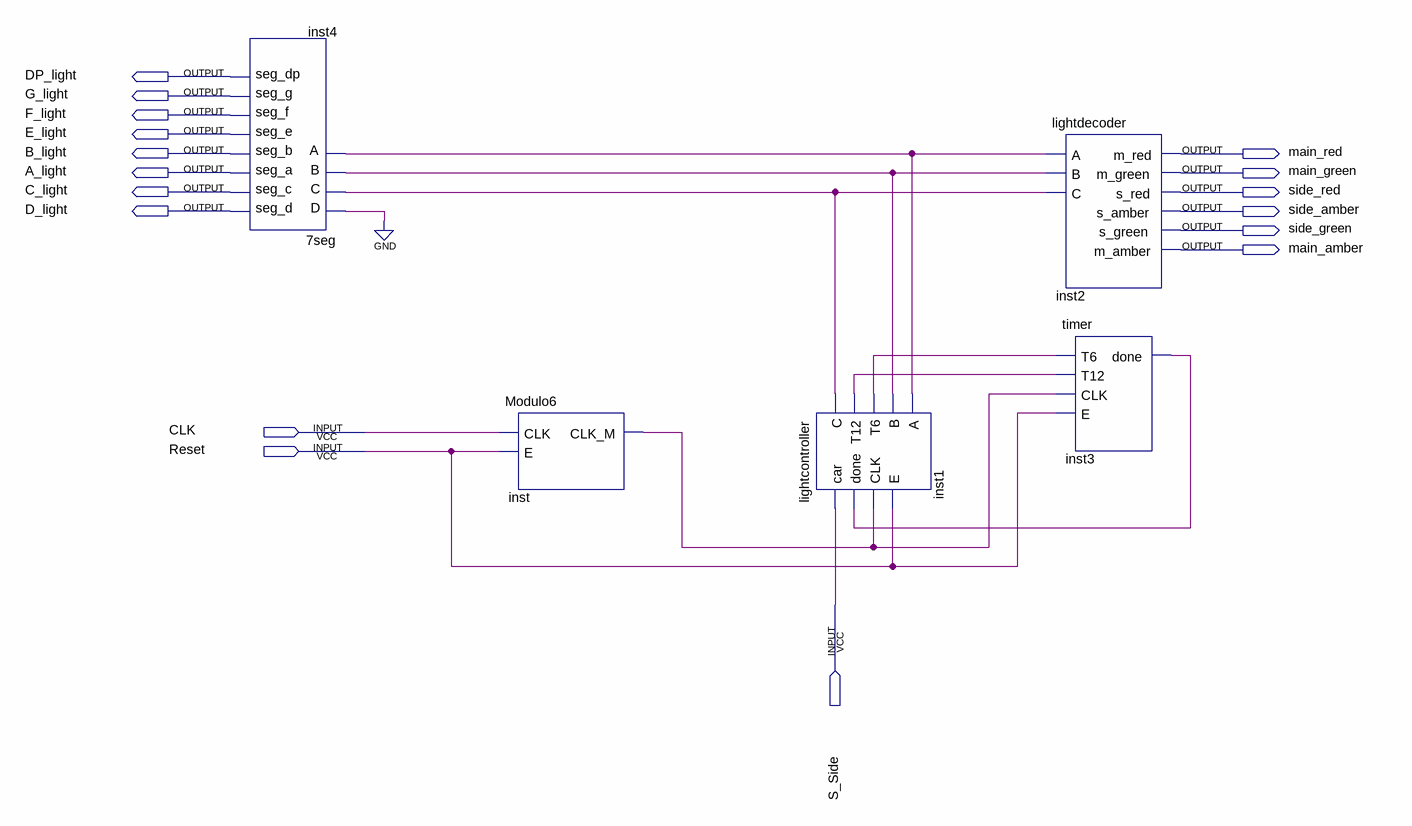
[diagram p0: schematic sheet]
// Quartus schematic trafficlight.bdf as structural Verilog: 5 symbols, 17 pins
module trafficlight (
  input  CLK,
  input  Reset,
  input  S_Side,
  output DP_light,
  output G_light,
  output F_light,
  output E_light,
  output B_light,
  output main_red,
  output A_light,
  output main_green,
  output C_light,
  output side_red,
  output D_light,
  output side_amber,
  output side_green,
  output main_amber
);

  wire inst1_a, inst1_b, inst1_c, inst1_t6, inst1_t12, inst3_done, inst_clk_m;

  \7seg  inst4 (
    .D(1'b0), .C(inst1_c), .B(inst1_b), .A(inst1_a), .seg_d(D_light), .seg_c(C_light), .seg_a(A_light),
    .seg_b(B_light), .seg_e(E_light), .seg_f(F_light), .seg_g(G_light), .seg_dp(DP_light));
  Modulo6 inst (.CLK(CLK), .E(Reset), .CLK_M(inst_clk_m));
  lightcontroller inst1 (
    .car(S_Side), .done(inst3_done), .CLK(inst_clk_m), .E(Reset), .C(inst1_c), .T12(inst1_t12),
    .T6(inst1_t6), .B(inst1_b), .A(inst1_a));
  lightdecoder inst2 (
    .A(inst1_a), .B(inst1_b), .C(inst1_c), .m_red(main_red), .m_green(main_green), .s_red(side_red),
    .s_amber(side_amber), .s_green(side_green), .m_amber(main_amber));
  timer inst3 (.T6(inst1_t6), .T12(inst1_t12), .CLK(inst_clk_m), .E(Reset), .done(inst3_done));
endmodule
